# Altium schematic sheet burnwire.SchDoc
size A; SheetNumber: 8; SheetTotal: 10
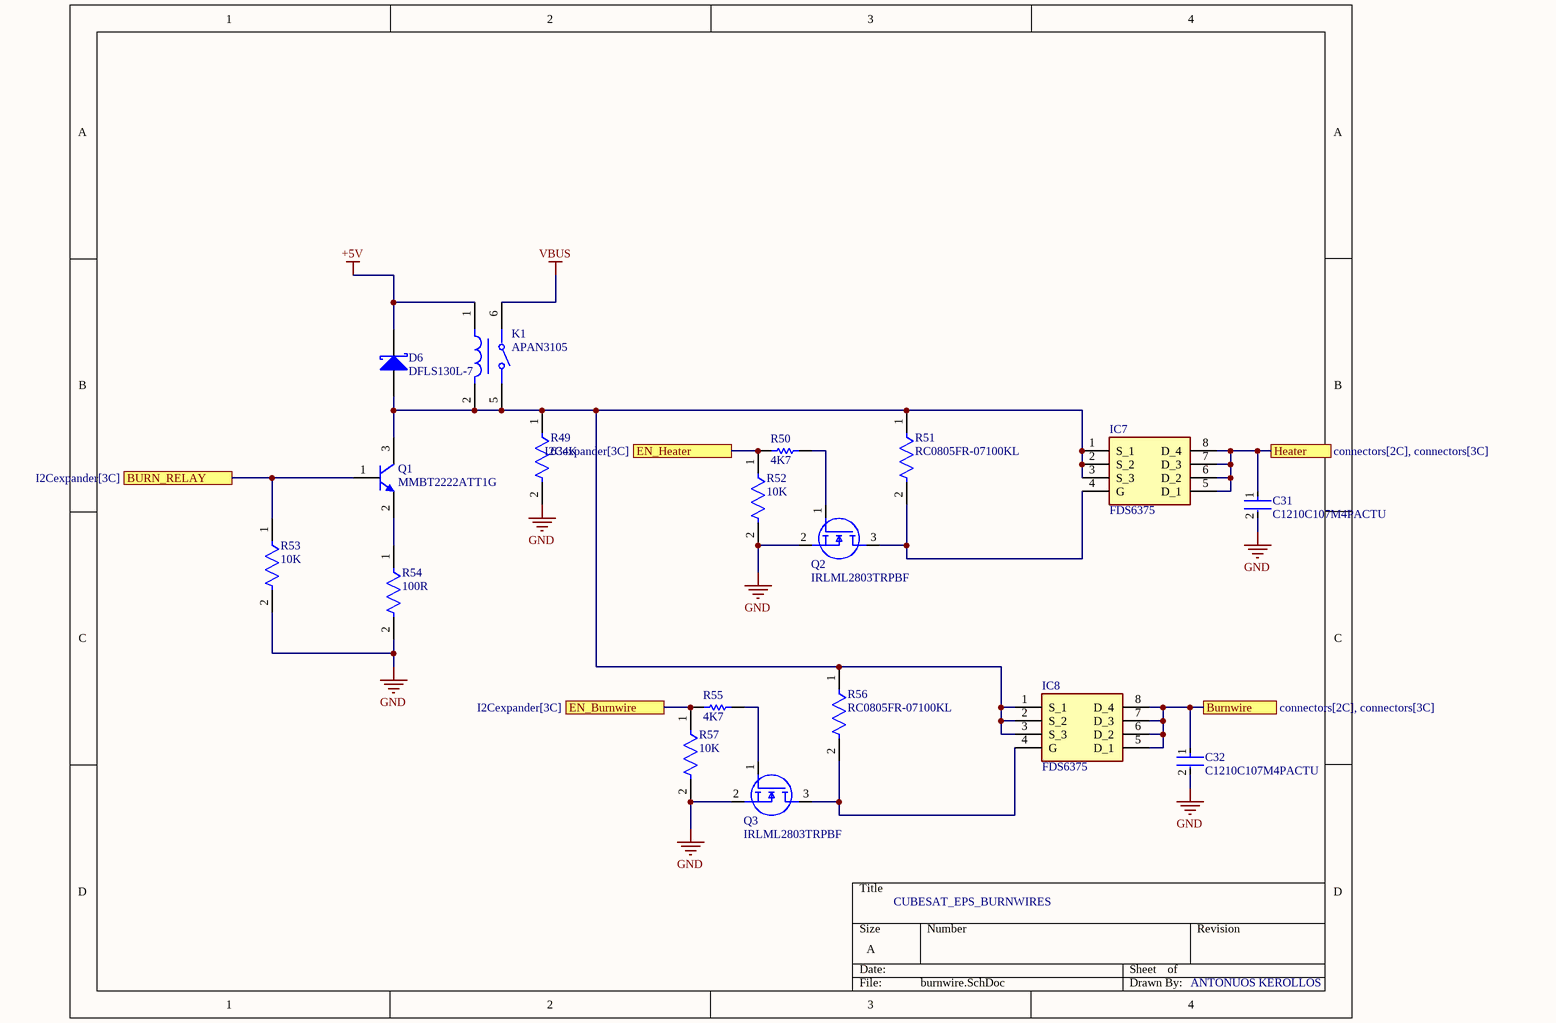
[diagram p0: burnwire.SchDoc]

## Parts
C31  C1210C107M4PACTU  [FP-C1210C-FS-MFG]
C32  C1210C107M4PACTU  [FP-C1210C-FS-MFG]
D6  DFLS130L-7  [DIOD-POWERDI123-2_A_V]
IC7  FDS6375  [SOIC127P600X175-8N]
IC8  FDS6375  [SOIC127P600X175-8N]
K1  APAN3105  [FP-APAN3105-MFG]
Q1  MMBT2222ATT1G  [ONSC-SC-75-3-463-01_V]
Q2  IRLML2803TRPBF  [SOT95P237X112-3N]
Q3  IRLML2803TRPBF  [SOT95P237X112-3N]
R49  634K  [FP-CRCW0805-e3-IPC_A]
R50  4K7  [YAGO-RC0805_M]
R51  RC0805FR-07100KL  [FP-RC0805-0_6-IPC_C]
R52  10K  [FP-CRCW0805-e3-IPC_A]
R53  10K  [FP-CRCW0805-e3-IPC_A]
R54  100R  [FP-RC0603-0_55-MFG]
R55  4K7  [YAGO-RC0805_M]
R56  RC0805FR-07100KL  [FP-RC0805-0_6-IPC_C]
R57  10K  [FP-CRCW0805-e3-IPC_A]

## Ports
BURN_RELAY (see I2Cexpander[3C]), Burnwire (see connectors[2C], connectors[3C]), EN_Burnwire (see I2Cexpander[3C]), EN_Heater (see I2Cexpander[3C]), Heater (see connectors[2C], connectors[3C])

## Nets
+5V: D6.2(K) K1.1
GND: C31.2 C32.2 Q2.2(S) Q3.2(S) R49.2 R52.2 R53.2 R54.2 R57.2
VBUS: K1.6(COM)
BURN_RELAY: Q1.1(B) R53.1 ; port BURN_RELAY
Burnwire: C32.1 IC8.5(D_1) IC8.6(D_2) IC8.7(D_3) IC8.8(D_4) ; port Burnwire
EN_Burnwire: R55.1 R57.1 ; port EN_Burnwire
EN_Heater: R50.1 R52.1 ; port EN_Heater
Heater: C31.1 IC7.5(D_1) IC7.6(D_2) IC7.7(D_3) IC7.8(D_4) ; port Heater
NetD6_1: D6.1(A) IC7.1(S_1) IC7.2(S_2) IC7.3(S_3) IC8.1(S_1) IC8.2(S_2) IC8.3(S_3) K1.2 K1.5(NO) Q1.3(C) R49.1 R51.1 R56.1
NetIC7_4: IC7.4(G) Q2.3(D) R51.2
NetIC8_4: IC8.4(G) Q3.3(D) R56.2
NetQ1_2: Q1.2(E) R54.1
NetQ2_1: Q2.1(G) R50.2
NetQ3_1: Q3.1(G) R55.2

## Notes on the sheet
- CUBESAT_EPS_BURNWIRES
- ANTONUOS KEROLLOS

## Library data of the parts
C31 C32 = CMP-03020-034653-1: CAP CER 100UF 16V X5R 1210; Tolerance: 20%; Dielectric Material: Ceramic; Max Operating Temperature: 85°C; REACH SVHC: No SVHC; Case Code (Metric): 3225; Case/Package: 1210; Thickness: 0.106inch; Length: 3.2mm; Min Operating Temperature: -55°C; Voltage Rating (DC): 16V; Weight: 0.000564oz; Packaging: Tape and Reel; Case Code (Imperial): 1210; Depth: 2.5mm; Lead Free: Lead Free; Width: 0.098inch; Voltage Rating: 16V; Capacitance: 100uF; Termination: SMD/SMT; Dielectric: X5R; Package Quantity: 1000
D6 = CMP-2000-07448-1: Schottky Barrier Rectifier, 30 V, 1 A, -40 to 125 degC, 2-Pin SMD, RoHS, Tape and Reel; Manufacturer: Diodes Inc; Max Repetitive Reverse Voltage (Vrrm): 30V; Polarity: Standard; Average Rectified Current: 1A; Element Configuration: Single; Forward Voltage: 360mV; Peak Non-Repetitive Surge Current: 50A; Max Power Dissipation: 1.67W; Case\/Package: SMD/SMT; Capacitance: 76pF; Peak Reverse Current: 1mA; Datasheet URL: https://www.diodes.com/assets/Datasheets/ds30492.pdf; Package Quantity: 3000; Reverse Voltage (DC): 30V; Package Reference: POWERDI123-2_A; Lead Free: LeadFree; Mounting Technology: SurfaceMount; Max Operating Temperature: 125degC; Current Rating: 1A; Radiation Hardening: No; Width: 1.78mm; Height: 0.98mm; Output Current: 1A; Contact Plating: Matte; Length: 2.8mm; Number of Pins: 2; Voltage Rating (DC): 30V; RoHSCompliant: true; Termination: SMD/SMT; Forward Current: 1A; Min Operating Temperature: -40degC; Datasheet Version: Rev. 4-2, 06/2009; Packaging: TapeandReel; REACH SVHC: NoSVHC; Max Forward Surge Current (Ifsm): 50A; Manufacturer URL: http://www.diodes.com/; Mount: SurfaceMount; Package Description: 2-Pin Small Outline Diode, Body 2.8 x 1.78 mm
IC7 IC8 = FDS6375: Integrated Circuit; Manufacturer_Name: onsemi; Datasheet Link: https://www.onsemi.com/pub/Collateral/FDS6375-D.pdf; Height: 1.75mm; Manufacturer_Part_Number: FDS6375; Mouser Part Number: 512-FDS6375; Mouser Price/Stock: https://www.mouser.co.uk/ProductDetail/onsemi-Fairchild/FDS6375?qs=HK%252BeIG1iaag0XY66%2FG8lnA%3D%3D; Arrow Part Number: FDS6375; Arrow Price/Stock: https://www.arrow.com/en/products/fds6375/on-semiconductor
K1 = CMP-05606-000084-1: RELAY GENERAL PURPOSE SPST 5A 5V; Coil Power: 110mW; Coil Type: Non-Latching; Coil Resistance: 227R; Coil Current: 22mA; Release Time: 5ms; Operate Time: 10ms; Contact Material: Gold; Termination: PC Pin; Contact Current Rating: 5A; Throw Configuration: SPST; Package Quantity: 25; Coil Voltage (DC): 5V; Lead Free: Lead Free; Mount: Through Hole; Min Operating Temperature: -40°C; Max Operating Temperature: 90°C; Packaging: Rail/Tube; RoHS Compliant: Yes; Relay Type: General Purpose
Q1 = CMP-1048-00417-1: General Purpose Transistor, NPN Silicon, 3-Pin SC-75, Pb-Free, Tape and Reel; Manufacturer: On Semiconductor; IC Continuous (A): 0.6; fT Min (MHz): 300; DatasheetVersion: Rev. 5; PackageVersion: Rev. F, 07/2005; ComponentLink1Description: Manufacturer URL; RoHS: TRUE; Packing: Tape and Reel; ComponentLink3URL: http://www.onsemi.com/pub_link/Collateral/463-01.PDF; ComponentLink1URL: http://www.onsemi.com/; ComponentLink3Description: Package Specification; ComponentLink2URL: http://www.onsemi.cn/pub_link/Collateral/MMBT2222ATT1-D.PDF; Mounting Technology: Surface Mount; PartNumber: MMBT2222ATT1G; ComponentLink2Description: Datasheet; Polarity: NPN; PackageReference: SC-75-3-463-01; PackageDescription: 3-Pin Small Outline Transistor, Body 1.6 x 0.8 mm, Pitch 0.5 mm
Q2 Q3 = IRLML2803TRPBF: MOSFET (N-Channel); Manufacturer_Name: Infineon; Datasheet Link: https://www.infineon.com/dgdl/irlml2803pbf.pdf?fileId=5546d462533600a4015356682aff260f; Height: 1.12mm; Manufacturer_Part_Number: IRLML2803TRPBF; Mouser Part Number: 942-IRLML2803TRPBF; Mouser Price/Stock: https://www.mouser.co.uk/ProductDetail/Infineon-Technologies/IRLML2803TRPBF?qs=9%252BKlkBgLFf2YYGlrpx3%252BKw%3D%3D; Arrow Part Number: IRLML2803TRPBF; Arrow Price/Stock: https://www.arrow.com/en/products/irlml2803trpbf/infineon-technologies-ag?utm_currency=USD&region=nac
R49 = CMP-1013-00827-2: RES Thick Film, 634kΩ, 1%, 0.125W, 100ppm/°C, 0805; Voltage Rating: 150V; Max Power Dissipation: 125mW; Resistance: 634kR; Weight: 0.000194oz; Max Operating Temperature: 155°C; Case Code (Metric): 2012; Height: 0.02inch; Temperature Coefficient: 100ppm/°C; Power Rating: 125mW; Length: 2mm; Contact Plating: Tin; Package Quantity: 10; Packaging: Tape and Reel; Min Operating Temperature: -55°C; Case Code (Imperial): 0805; Termination: SMD/SMT; Composition: Thick Film; Case/Package: 0805; Lead Free: Lead Free; Voltage Rating (DC): 150V; Width: 0.049inch; Features: Automotive AEC-Q200; Tolerance: 1%; Radiation Hardening: No; Depth: 1.25mm; Military Standard: Not; Number of Terminations: 2
R50 R55 = CMP-1568-00001-1: General Puprose Chip Resistor, 4700 Ohm +/- 1%, 0.125 W, -55 to 155 degC, 2-Pin SMD, RoHS, Tape and Reel; PartNumber: RC0805FR-074K7L; Tolerance: +/- 1%; Power: 0.125 W; PackageDescription: 2-Pin Surface Mount Device, Body 2 x 1.25 mm; ComponentLink2URL: http://www.yageo.com/documents/recent/PYu-RC_Group_51_RoHS_L-3.pdf; Temperature Min: -55 degC; Packing: Tape and Reel; Mounting Technology: Surface Mount; ComponentLink1URL: http://www.yageo.com/NewPortal/_en/index.jsp; Resistance: 4700 Ohm; Temperature Max: 155 degC; ComponentLink2Description: Datasheet; DatasheetVersion: Rev. 3; RoHS: TRUE; ComponentLink1Description: Manufacturer URL
R51 R56 = CMP-2100-03668-5: RES 100K OHM 1% 1/8W 0805; Power Rating: 125mW; Temperature Coefficient: 100ppm/°C; Voltage Rating (DC): 150V; Resistance: 100kR; Package Quantity: 1; Case/Package: 0805; Lead Pitch: 0.4mm; Case Code (Imperial): 0805; Construction: Rectangular; Number of Terminations: 2; RoHS Compliant: Yes; Max Power Dissipation: 125mW; Tolerance: 1%; Max Operating Temperature: 155°C; Resistance Tolerance: 1%; Lead Free: Lead Free; Packaging: Tape and Reel; Resistor Type: Thick Film; Min Operating Temperature: -55°C; Case Code (Metric): 2012; Series: RC; Technology: THICK FILM; Voltage Rating: 150V; Termination: SMD/SMT; Width: 0.049inch; Number of Pins: 2; Features: Moisture Resistant; Military Standard: Not; Length: 0.079inch; Depth: 1.25mm; Size Code: 0805; Height: 0.024inch
R52 R53 R57 = CMP-2001-04908-2: RES Thick Film, 10kΩ, 1%, 0.125W, 100ppm/°C, 0805; Resistance: 10kR; Voltage Rating (DC): 150V; Power Rating: 125mW; Weight: 0.000194oz; Package Quantity: 5000; Military Standard: Not; Max Operating Temperature: 155°C; Temperature Coefficient: 100ppm/°C; Contact Plating: Tin; Width: 1.25mm; Height: 0.45mm; Radiation Hardening: No; Tolerance: 1%; Min Operating Temperature: -55°C; Voltage Rating: 150V; Length: 2mm; Depth: 1.25mm; Termination: SMD/SMT; Packaging: Tape and Reel; Case/Package: 0805; Case Code (Metric): 2012; Lead Free: Lead Free; Case Code (Imperial): 0805; Composition: Thick Film
R54 = CMP-2100-03663-2: NexarPartId: 55402879; Voltage Rating: 50V; Power Rating: 100mW; Tolerance: 1%; Temperature Coefficient: 100ppm/°C; Resistance: 100Ω; Case/Package: 0603; Military Standard: Not; REACH SVHC: Unknown; Case Code (Metric): 0603; Max Operating Temperature: 155°C; Schedule B: 8533210045, 8533210045; Height: 450µm; Length: 1.6mm; Lead Free: Lead Free; Packaging: Tape & Reel; Case Code (Imperial): 0603; Composition: Thick Film; Min Operating Temperature: -55°C; Voltage Rating (DC): 50V; RoHS: Compliant; Depth: 800µm; Number of Pins: 2; Termination: SMD/SMT; Width: 800µm